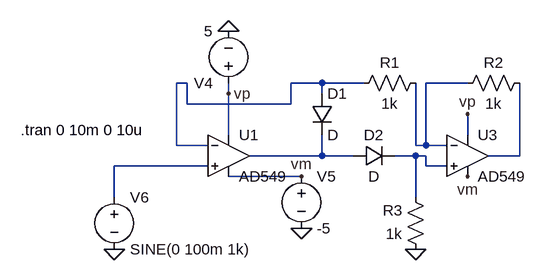
[diagram p0: schematic double-rectifier.asc]
double-rectifier.asc, the LTspice schematic file:
Version 4
SHEET 1 936 680
WIRE 32 -48 16 -48
WIRE 240 -48 192 -48
WIRE 304 -48 240 -48
WIRE 464 -48 400 -48
WIRE 96 -32 96 -48
WIRE 240 -32 240 -48
WIRE 32 -16 32 -48
WIRE 192 -16 192 -48
WIRE 192 -16 32 -16
WIRE 96 32 96 -32
WIRE 464 32 464 0
WIRE 16 48 16 -48
WIRE 64 48 16 48
WIRE 384 48 384 -48
WIRE 400 48 400 -48
WIRE 400 48 384 48
WIRE 432 48 400 48
WIRE 240 64 240 32
WIRE 240 64 128 64
WIRE 288 64 240 64
WIRE 384 64 352 64
WIRE 400 64 384 64
WIRE 544 64 544 -48
WIRE 544 64 496 64
WIRE 64 80 -80 80
WIRE 400 80 400 64
WIRE 432 80 400 80
WIRE 208 96 96 96
WIRE -80 128 -80 80
WIRE 384 128 384 64
FLAG -80 208 0
FLAG 208 176 0
FLAG 96 -128 0
FLAG 384 208 0
FLAG 96 -32 vp
FLAG 208 96 vm
FLAG 464 96 vm
FLAG 464 0 vp
SYMBOL OpAmps\\AD549 464 0 R0
SYMATTR InstName U3
SYMBOL voltage 96 -32 R180
WINDOW 123 0 0 Left 0
WINDOW 39 0 0 Left 0
SYMATTR InstName V4
SYMATTR Value 5
SYMBOL voltage 208 80 R0
WINDOW 123 0 0 Left 0
WINDOW 39 0 0 Left 0
SYMATTR InstName V5
SYMATTR Value -5
SYMBOL voltage -80 112 R0
WINDOW 123 0 0 Left 0
WINDOW 39 0 0 Left 0
SYMATTR InstName V6
SYMATTR Value SINE(0 100m 1k)
SYMBOL OpAmps\\AD549 96 0 R0
SYMATTR InstName U1
SYMBOL diode 224 -32 R0
SYMATTR InstName D1
SYMBOL diode 288 80 R270
WINDOW 0 32 32 VTop 2
WINDOW 3 0 32 VBottom 2
SYMATTR InstName D2
SYMBOL res 400 -64 R90
WINDOW 0 0 56 VBottom 2
WINDOW 3 32 56 VTop 2
SYMATTR InstName R1
SYMATTR Value 1k
SYMBOL res 560 -64 R90
WINDOW 0 0 56 VBottom 2
WINDOW 3 32 56 VTop 2
SYMATTR InstName R2
SYMATTR Value 1k
SYMBOL res 400 224 R180
WINDOW 0 36 76 Left 2
WINDOW 3 36 40 Left 2
SYMATTR InstName R3
SYMATTR Value 1k
TEXT -224 24 Left 2 !.tran 0 10m 0 10u

The netlist it stands for:
* double-rectifier.asc
XU3 N004 N002 vp vm N005 AD549  ; pins In+ In- V+ V- OUT
V4 vp 0 5
V5 vm 0 -5
V6 N006 0 SINE(0 100m 1k)
XU1 N006 N001 vp vm N003 AD549  ; pins In+ In- V+ V- OUT
D1 N001 N003 D
D2 N003 N004 D
R1 N002 N001 1k
R2 N005 N002 1k
R3 0 N004 1k
.model D D
.lib standard.dio
.tran 0 10m 0 10u
.backanno
.end